# Altium schematic sheet LDOs.SchDoc
size 420 x 297 mm; Address1: Address1; Address2: Address2; Address3: Address3; Address4: Address4; SheetNumber: 1; Scale: 1:1; Разраб.: Иванов; Обозначение документа: АБВГ.123456.001 Э3; Пров.: Петров; Утв.: Сидоров; Наименование организации: ОАО "Концерн "МПО-Гидроприбор"; Перв. применение: АБВГ.123456.000; Наименование изделия 1: Плата; Наименование изделия 2: Схема электрическая; Наименование изделия 3: принципиальная; Нач. отд.: Нач. отд.; Фамилия нач. отд.: Сидоров
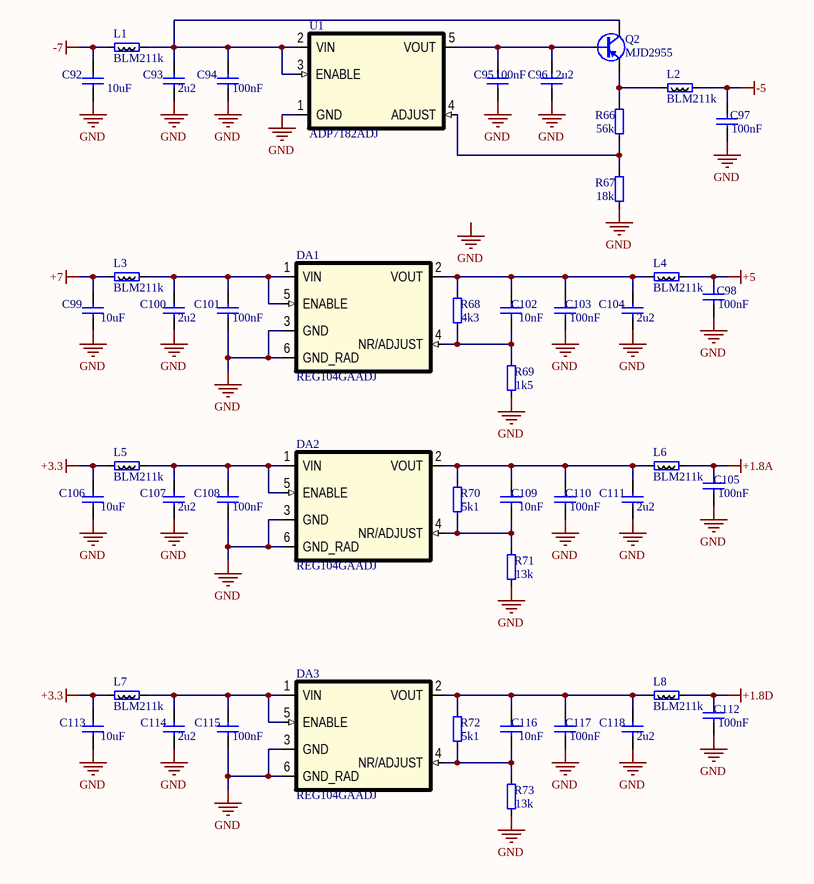
[diagram p0: LDOs.SchDoc]

## Parts
C92  10uF  [0805]
C93  2u2  [0805]
C94  100nF  [0805]
C95  100nF  [0805]
C96  2u2  [0805]
C97  100nF  [0805]
C98  100nF  [0805]
C99  10uF  [0805]
C100  2u2  [0805]
C101  100nF  [0805]
C102  10nF  [0805]
C103  100nF  [0805]
C104  2u2  [0805]
C105  100nF  [0805]
C106  10uF  [0805]
C107  2u2  [0805]
C108  100nF  [0805]
C109  10nF  [0805]
C110  100nF  [0805]
C111  2u2  [0805]
C112  100nF  [0805]
C113  10uF  [0805]
C114  2u2  [0805]
C115  100nF  [0805]
C116  10nF  [0805]
C117  100nF  [0805]
C118  2u2  [0805]
DA1  REG104GAADJ  [SOT223_6-127]
DA2  REG104GAADJ  [SOT223_6-127]
DA3  REG104GAADJ  [SOT223_6-127]
L1  BLM211k  [0805]
L2  BLM211k  [0805]
L3  BLM211k  [0805]
L4  BLM211k  [0805]
L5  BLM211k  [0805]
L6  BLM211k  [0805]
L7  BLM211k  [0805]
L8  BLM211k  [0805]
Q2  MJD2955  [DPAK]
R66  56k  [0805]
R67  18k  [0805]
R68  4k3  [0805]
R69  1k5  [0805]
R70  5k1  [0805]
R71  13k  [0805]
R72  5k1  [0805]
R73  13k  [0805]
U1  ADP7182ADJ  [SOT23-5]

## Nets
+1.8A: C105.2 L6.2
+1.8D: C112.2 L8.2
+3.3: C106.2 C113.2 L5.1 L7.1
+5: C98.2 L4.2
+7: C99.2 L3.1
-5: C97.2 L2.2
-7: C92.2 L1.1
GND: C92.1 C93.1 C94.1 C95.1 C96.1 C97.1 C98.1 C99.1 C100.1 C101.1 C103.1 C104.1 C105.1 C106.1 C107.1 C108.1 C110.1 C111.1 C112.1 C113.1 C114.1 C115.1 C117.1 C118.1 DA1.3(GND) DA1.6(GND_RAD) DA2.3(GND) DA2.6(GND_RAD) DA3.3(GND) DA3.6(GND_RAD) R67.1 R69.1 R71.1 R73.1 U1.1(GND)
NetC93_2: C93.2 C94.2 L1.2 Q2.3(C) U1.2(VIN) U1.3(ENABLE)
NetC95_2: C95.2 C96.2 Q2.1(B) U1.5(VOUT)
NetC100_2: C100.2 C101.2 DA1.1(VIN) DA1.5(ENABLE) L3.2
NetC102_1: C102.1 DA1.4(NR/ADJUST) R68.1 R69.2
NetC102_2: C102.2 C103.2 C104.2 DA1.2(VOUT) L4.1 R68.2
NetC107_2: C107.2 C108.2 DA2.1(VIN) DA2.5(ENABLE) L5.2
NetC109_1: C109.1 DA2.4(NR/ADJUST) R70.1 R71.2
NetC109_2: C109.2 C110.2 C111.2 DA2.2(VOUT) L6.1 R70.2
NetC114_2: C114.2 C115.2 DA3.1(VIN) DA3.5(ENABLE) L7.2
NetC116_1: C116.1 DA3.4(NR/ADJUST) R72.1 R73.2
NetC116_2: C116.2 C117.2 C118.2 DA3.2(VOUT) L8.1 R72.2
NetL2_1: L2.1 Q2.2(E) R66.2
NetR66_1: R66.1 R67.2 U1.4(ADJUST)

## Notes on the sheet
- Labels drawn without touching a wire or pin: GND
- Подп. и дата
- Инв. № дубл.
- Взам. инв. №
- Инв. № подл.
- Изм.
- Лист
- № докум.
- Подп.
- Дата
- Копировал
- Формат А3

## Library data of the parts
C92-C118 = Capacitor
DA1-DA3 = REG104GA: Positive LDO Linear stabilizer; Vendor: Texas Instruments; Value: ADJ; SMD Solders: 6; Solder Option: RM; TC: 70ppm/C; Tolerance: +-2% Max; Pkg: SOT223-6; Name to order: REG104GA-A; Vref: 1V295; Price: 1000; Device: REG104GA
L1-L8 = BLM21: SMD Ferrite bead 0805; Vendor: Vishay; Value: 1k; Pkg: SMD0805; SMD Solders: 2; Solder Option: RM; Price: 10; Device: BLM21
Q2 = MJD2955: PNP транзистор; Vendor: ON Semiconductor; SMD Solders: 3; Solder Option: RM; Name to order: MJD29G55; Voltage: -60V; Pkg: DPAK; Price: 100; Device: MJD2955
R66-R73 = Resistor
U1 = ADP7182: Negative LDO Linear stabilizer; Vendor: Analog Devoces; Value: ADJ; SMD Solders: 5; Solder Option: RM; Name to order: ADP7182AUJZ-R7; Vref: 1V22; Pkg: SOT23-5; Price: 100; Device: ADP7182